# EAGLE design RHD2132-Millmax-RightAngle (EAGLE 9.6.2)
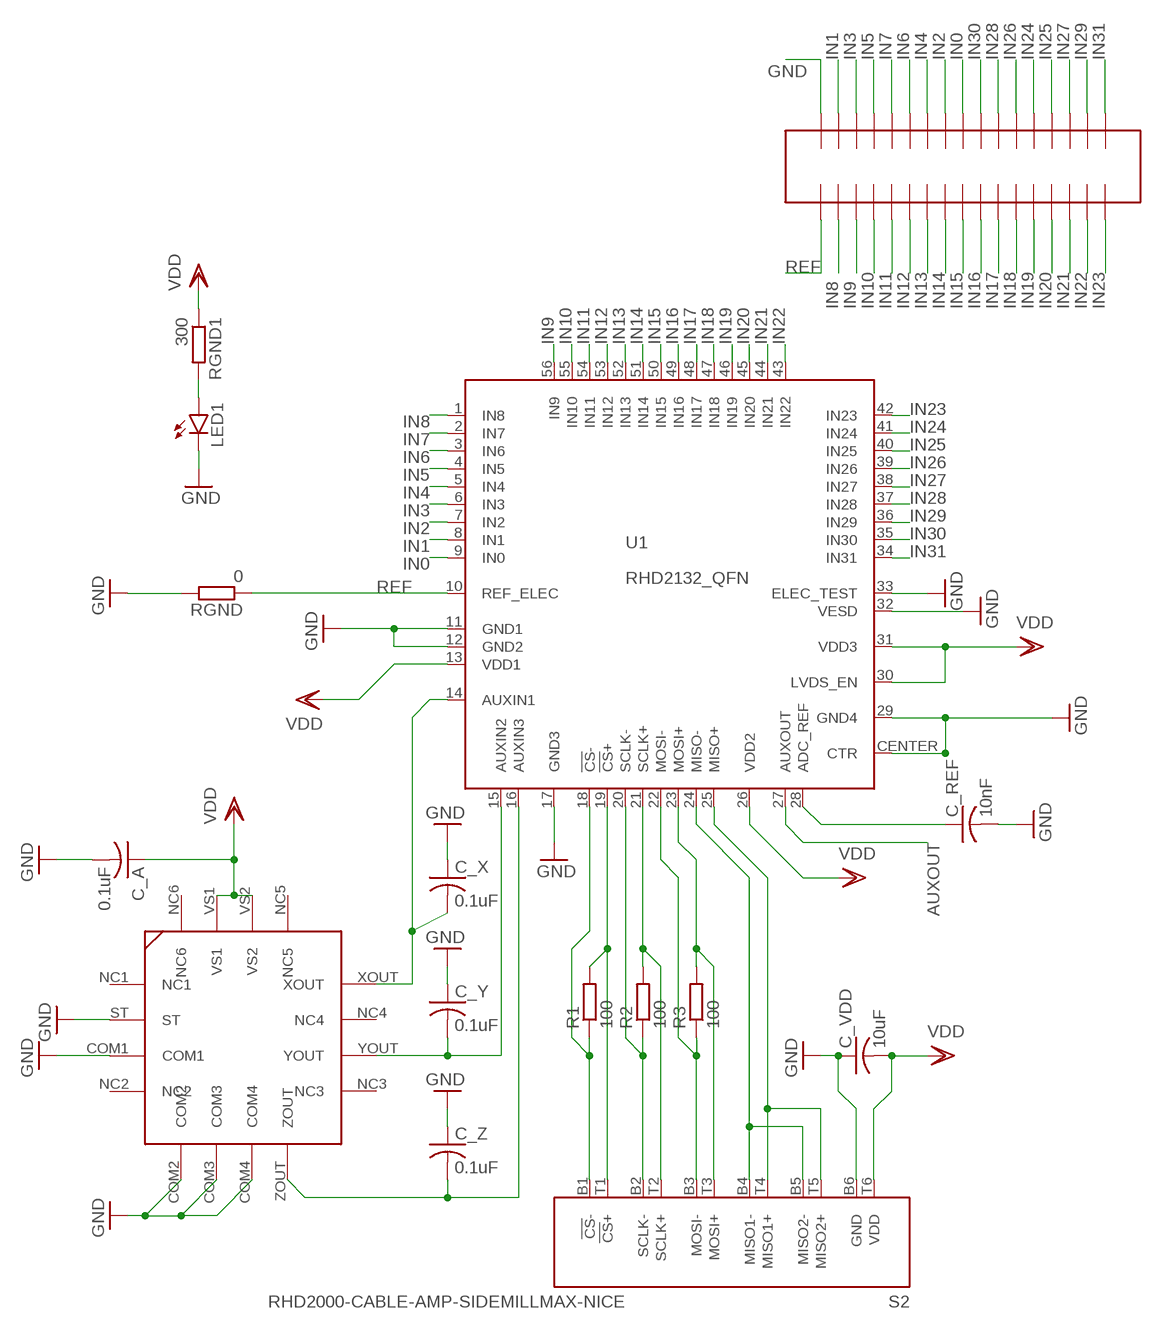
[diagram p0: schematic, sheet 1]

## Parts
C_A  0.1uF  C-USC0402K  [C0402K]
C_REF  10nF  C-USC0402K  [C0402K]
C_VDD  10uF  C-USC1206  [C1206]
C_X  0.1uF  C-USC0402K  [C0402K]
C_Y  0.1uF  C-USC0402K  [C0402K]
C_Z  0.1uF  C-USC0402K  [C0402K]
LED1  LEDCHIPLED_0805  [CHIPLED_0805]
R1  100  R-EU_R0402  [R0402]
R2  100  R-EU_R0402  [R0402]
R3  100  R-EU_R0402  [R0402]
RGND  0  R-EU_R0402  [R0402]
RGND1  300  R-EU_R0402  [R0402]
S2  RHD2000-CABLE-AMP-SIDEMILLMAX-NICE  [MILLMAX-12PIN-NICE]
U1  RHD2132_QFN  [QFN56_8_X_8_LARGE]
U$1  ADXL335  [ADXL335]
U$2  FTSH-117BOARD-END  [FTSH-117-END]

## Nets
ADC_REF: C_REF.1 U1.28(ADC_REF)
AUXOUT: U1.27(AUXOUT)
CS+: R1.2 S2.T1(!CS!+) U1.19(!CS!+)
CS-: R1.1 S2.B1(!CS!-) U1.18(!CS!-)
GND: C_A.2 C_REF.2 C_VDD.1 C_X.1 C_Y.1 C_Z.1 LED1.C RGND.2 S2.B6(GND) U1.11(GND1) U1.12(GND2) U1.17(GND3) U1.29(GND4) U1.32(VESD) U1.33(ELEC_TEST) U1.CENTER(CTR) U$1.COM1 U$1.COM2 U$1.COM3 U$1.COM4 U$1.ST U$2.P$34
IN0: U1.9(IN0) U$2.P$26
IN1: U1.8(IN1) U$2.P$33
IN2: U1.7(IN2) U$2.P$27
IN3: U1.6(IN3) U$2.P$32
IN4: U1.5(IN4) U$2.P$28
IN5: U1.4(IN5) U$2.P$31
IN6: U1.3(IN6) U$2.P$29
IN7: U1.2(IN7) U$2.P$30
IN8: U1.1(IN8) U$2.P$2
IN9: U1.56(IN9) U$2.P$3
IN10: U1.55(IN10) U$2.P$4
IN11: U1.54(IN11) U$2.P$5
IN12: U1.53(IN12) U$2.P$6
IN13: U1.52(IN13) U$2.P$7
IN14: U1.51(IN14) U$2.P$8
IN15: U1.50(IN15) U$2.P$9
IN16: U1.49(IN16) U$2.P$10
IN17: U1.48(IN17) U$2.P$11
IN18: U1.47(IN18) U$2.P$12
IN19: U1.46(IN19) U$2.P$13
IN20: U1.45(IN20) U$2.P$14
IN21: U1.44(IN21) U$2.P$15
IN22: U1.43(IN22) U$2.P$16
IN23: U1.42(IN23) U$2.P$17
IN24: U1.41(IN24) U$2.P$22
IN25: U1.40(IN25) U$2.P$21
IN26: U1.39(IN26) U$2.P$23
IN27: U1.38(IN27) U$2.P$20
IN28: U1.37(IN28) U$2.P$24
IN29: U1.36(IN29) U$2.P$19
IN30: U1.35(IN30) U$2.P$25
IN31: U1.34(IN31) U$2.P$18
MISO1+: S2.T4(MISO1+) S2.T5(MISO2+) U1.25(MISO+)
MISO1-: S2.B4(MISO1-) S2.B5(MISO2-) U1.24(MISO-)
MOSI+: R3.2 S2.T3(MOSI+) U1.23(MOSI+)
MOSI-: R3.1 S2.B3(MOSI-) U1.22(MOSI-)
N$1: LED1.A RGND1.2
REF: RGND.1 U1.10(REF_ELEC) U$2.P$1
SCLK+: R2.2 S2.T2(SCLK+) U1.21(SCLK+)
SCLK-: R2.1 S2.B2(SCLK-) U1.20(SCLK-)
VDD: C_A.1 C_VDD.2 RGND1.1 S2.T6(VDD) U1.13(VDD1) U1.26(VDD2) U1.30(LVDS_EN) U1.31(VDD3) U$1.VS1 U$1.VS2
XOUT: C_X.2 U1.14(AUXIN1) U$1.XOUT
YOUT: C_Y.2 U1.15(AUXIN2) U$1.YOUT
ZOUT: C_Z.2 U1.16(AUXIN3) U$1.ZOUT
Unconnected: U$1.NC1 U$1.NC2 U$1.NC3 U$1.NC4 U$1.NC5 U$1.NC6

## Library data of the parts
C_A C_REF C_VDD C_X C_Y C_Z = resistor:C-US: CAPACITOR, American symbol
LED1 = led:LED: LED OSRAM: - CHIPLED LG R971, LG N971, LY N971, LG Q971, LY Q971, LO R971, LY R971 LH N974, LH R974 LS Q976, LO Q976, LY Q976 LO Q996 - Hyper CHIPLED LW Q18S LB Q993, LB Q99A, LB R99A - SideLED LS A670, LO A670, LY A670, LG A670, LP A670 LB A673, LV A673, LT A673, LW A673 LH A674 LY A675 LS A676, LA A676, LO A676, LY A676, LW A676 LS A679, LY A679, LG A679 - Hyper Micro SIDELED® LS Y876, LA Y876, LO Y876, LY Y876 LT Y87S - SmartLED LW L88C, LW L88S LB L89C, LB L89S, LG L890 LS L89K, LO L89K, LY L89K LS L896, LA L896, LO L896, LY L896 - TOPLED LS T670, LO T670, LY T670, LG T670, LP T670 LSG T670, LSP T670, LSY T670, LOP T670, LYG T670 LG T671, LOG T671, LSG T671 LB T673, LV T673, LT T673, LW T673 LH T674 LS T676, LA T676, LO T676, LY T676, LB T676, LH T676, LSB T676, LW T676 LB T67C, LV T67C, LT T67C, LS T67K, LO T67K, LY T67K, LW E67C LS E67B, LA E67B, LO E67B, LY E67B, LB E67C, LV E67C, LT E67C LW T67C LS T679, LY T679, LG T679 LS T770, LO T770, LY T770, LG T770, LP T770 LB T773, LV T773, LT T773, LW T773 LH T774 LS E675, LA E675, LY E675, LS T675 LS T776, LA T776, LO T776, LY T776, LB T776 LHGB T686 LT T68C, LB T68C - Hyper Mini TOPLED® LB M676 - Mini TOPLED Santana® LG M470 LS M47K, LO M47K, LY M47K Source: http://www.osram.convergy.de LUXEON: - LUMILED® LXK2-PW12-R00, LXK2-PW12-S00, LXK2-PW14-U00, LXK2-PW14-V00 LXK2-PM12-R00, LXK2-PM12-S00, LXK2-PM14-U00 LXK2-PE12-Q00, LXK2-PE12-R00, LXK2-PE12-S00, LXK2-PE14-T00, LXK2-PE14-U00 LXK2-PB12-K00, LXK2-PB12-L00, LXK2-PB12-M00, LXK2-PB14-N00, LXK2-PB14-P00, LXK2-PB14-Q00 LXK2-PR12-L00, LXK2-PR12-M00, LXK2-PR14-Q00, LXK2-PR14-R00 LXK2-PD12-Q00, LXK2-PD12-R00, LXK2-PD12-S00 LXK2-PH12-R00, LXK2-PH12-S00 LXK2-PL12-P00, LXK2-PL12-Q00, LXK2-PL12-R00 Source: www.luxeon.com KINGBRIGHT: KA-3528ASYC Source: www.kingbright.com
R1-R3 RGND RGND1 = resistor:R-EU_: RESISTOR, European symbol
S2 = RHD2132-Millmax-RightAngle:RHD2000-CABLE-AMP-SIDE: Omnetics A79623 PZN-12-AA connector for SPI interface (amplifier side)
U1 = RHD2000:RHD2132: Intan Technologies RHD2132 chip
U$1 = RHD2132-Millmax-RightAngle:ADXL335: The ADXL335 is a small, thin, low power, complete 3-axis accelerometer with signal conditioned voltage outputs. The product measures acceleration with a minimum full-scale range of ±3 g. It can measure the static acceleration of gravity in tilt-sensing applications, as well as dynamic acceleration resulting from motion, shock, or vibration. The user selects the bandwidth of the accelerometer using the CX, CY, and CZ capacitors at the XOUT, YOUT, and ZOUT pins. Bandwidths can be selected to suit the application, with a range of 0.5 Hz to 1600 Hz for the X and Y axes, and a range of 0.5 Hz to 550 Hz for the Z axi
U$2 = Samtec50Mil:FTSH-117: FTSH-117 17x2 Samtec Header 2 row 50 mil spacing

## Board
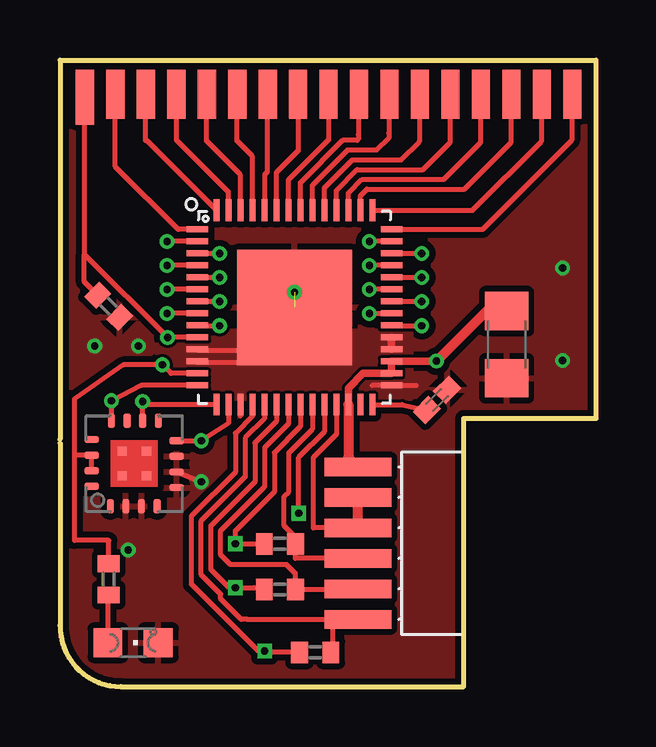
[diagram p1: board, top side]
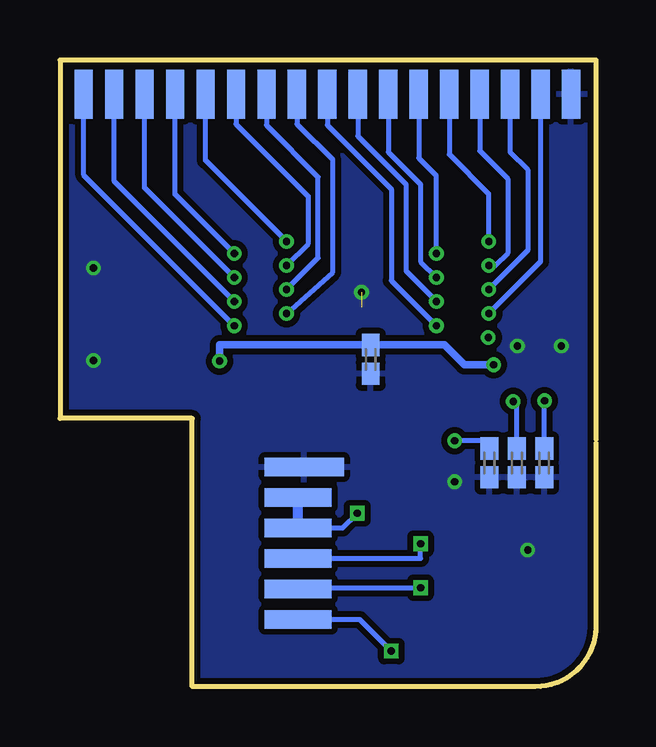
[diagram p2: board, bottom side, seen from below]

Size 22.35 x 26.11 mm. Coordinates in mm from the lower left corner, seen from the top.
Outline: 0,10.3 0,26.11 22.35,26.11 22.35,11.18 16.84,11.18 16.84,0 2.54,0 arc-90 0,2.54 0,10.16
Copper layers (1*16): Top 0.035mm / dielectric 1.5mm / Bottom 0.035mm
Design rules "MF_Standard_2_Layer": minimum track width 5mil, minimum drill 12mil, track to track 5mil, track to pad 5mil, pad to pad 5mil, via to via 5mil, smd to smd 0mil, copper to edge 10mil, drill to drill 10mil, minimum pad ring 6mil, minimum via ring 6mil, stop-mask expansion 2mil, vias tented up to drill 25mil, thermal gap 10mil

### Footprints (pad centres in the part's own frame; a part is rotated, then mirrored left to right if it is on the bottom)
C0402K = smd 0.925 x 0.74: 1 -0.6,0; 2 0.6,0
C1206 = smd 1.6 x 1.8: 1 -1.4,0; 2 1.4,0
CHIPLED_0805 = smd 1.2 x 1.2: A 0,-1.05; C 0,1.05
R0402 = smd 0.7 x 0.9: 1 -0.65,0; 2 0.65,0
MILLMAX-12PIN-NICE = smd 0.762 x 2.794 bottom: B1 3.175,-3.429; B2 1.905,-3.429; B3 0.635,-3.429; B4 -0.635,-3.429; B5 -1.905,-3.429 | smd 0.762 x 3.302 bottom: B6 -3.175,-3.683 | smd 0.762 x 2.794: T1 3.175,-3.429; T2 1.905,-3.429; T3 0.635,-3.429; T4 -0.635,-3.429; T5 -1.905,-3.429; T6 -3.175,-3.429
QFN56_8_X_8_LARGE = smd 0.9 x 0.25: 1 -4.05,3.25; 2 -4.05,2.75; 3 -4.05,2.25; 4 -4.05,1.75; 5 -4.05,1.25; 6 -4.05,0.75; 7 -4.05,0.25; 8 -4.05,-0.25; 9 -4.05,-0.75; 10 -4.05,-1.25; 11 -4.05,-1.75; 12 -4.05,-2.25; 13 -4.05,-2.75; 14 -4.05,-3.25; 29 4.05,-3.25; 30 4.05,-2.75; 31 4.05,-2.25; 32 4.05,-1.75; 33 4.05,-1.25; 34 4.05,-0.75; 35 4.05,-0.25; 36 4.05,0.25; 37 4.05,0.75; 38 4.05,1.25; 39 4.05,1.75; 40 4.05,2.25; 41 4.05,2.75; 42 4.05,3.25 | smd 0.25 x 0.9: 15 -3.25,-4.05; 16 -2.75,-4.05; 17 -2.25,-4.05; 18 -1.75,-4.05; 19 -1.25,-4.05; 20 -0.75,-4.05; 21 -0.25,-4.05; 22 0.25,-4.05; 23 0.75,-4.05; 24 1.25,-4.05; 25 1.75,-4.05; 26 2.25,-4.05; 27 2.75,-4.05; 28 3.25,-4.05; 43 3.25,4.05; 44 2.75,4.05; 45 2.25,4.05; 46 1.75,4.05; 47 1.25,4.05; 48 0.75,4.05; 49 0.25,4.05; 50 -0.25,4.05; 51 -0.75,4.05; 52 -1.25,4.05; 53 -1.75,4.05; 54 -2.25,4.05; 55 -2.75,4.05; 56 -3.25,4.05 | smd 4.8 x 4.8: CENTER 0,0 | smd 0.635 x 0.635: P$1 -1.905,1.905; P$2 -0.635,1.905; P$3 0.635,1.905; P$4 1.905,1.905; P$5 1.905,0.635; P$6 0.635,0.635; P$7 -0.635,0.635; P$8 -1.905,0.635; P$9 -1.905,-0.635; P$10 -0.635,-0.635; P$11 0.635,-0.635; P$12 1.905,-0.635; P$13 1.905,-1.905; P$14 0.635,-1.905; P$15 -0.635,-1.905; P$16 -1.905,-1.905
ADXL335 = smd 0.61 x 0.305: COM1 -1.775,-0.3; NC1 -1.775,1; NC2 -1.775,-0.95; NC3 1.775,-1; NC4 1.775,0.3; ST -1.775,0.35; XOUT 1.775,0.95; YOUT 1.775,-0.35 | smd 0.305 x 0.61: COM2 -1,-1.775; COM3 -0.35,-1.775; COM4 0.3,-1.775; NC5 1,1.775; NC6 -0.95,1.775; VS1 0.35,1.775; VS2 -0.3,1.775; ZOUT 0.95,-1.775 | smd 0.381 x 0.381: P$1 -0.508,0.508; P$2 0.508,0.508; P$3 0.508,-0.508; P$4 -0.508,-0.508
FTSH-117-END = smd 0.762 x 2.286: P$1 -10.16,-0.127 | smd 0.762 x 2.032: P$2 -8.89,0; P$3 -7.62,0; P$4 -6.35,0; P$5 -5.08,0; P$6 -3.81,0; P$7 -2.54,0; P$8 -1.27,0; P$9 0,0; P$10 1.27,0; P$11 2.54,0; P$12 3.81,0; P$13 5.08,0; P$14 6.35,0; P$15 7.62,0; P$16 8.89,0; P$17 10.16,0 | smd 0.762 x 2.032 bottom: P$18 10.16,0; P$19 8.89,0; P$20 7.62,0; P$21 6.35,0; P$22 5.08,0; P$23 3.81,0; P$24 2.54,0; P$25 1.27,0; P$26 0,0; P$27 -1.27,0; P$28 -2.54,0; P$29 -3.81,0; P$30 -5.08,0; P$31 -6.35,0; P$32 -7.62,0; P$33 -8.89,0; P$34 -10.16,0

### Placement (x,y rotation side)
C_A  9.4,13.64 270 bottom
C_REF  15.73,11.95 45 top
C_VDD  18.63,14.25 90 top
C_X  2.16,9.32 90 bottom
C_Y  3.3,9.32 90 bottom
C_Z  4.45,9.32 90 bottom
LED1  3.05,1.83 270 top
R1  10.64,1.43 0 top
R2  9.17,4.05 0 top
R3  9.17,5.95 0 top
RGND  2.03,15.85 315 top
RGND1  2.03,4.47 270 top
S2  15.85,5.98 270 top
U1  9.78,15.8 0 top
U$1  3.1,9.3 90 top
U$2  11.2,24.69 0 top

### Tracks (layer width: path | path; a pad name or v marks a point on that pad's centre or on a via)
ADC_REF
  Top 0.203: U1.28 14.26,11.75 C_REF.1
CS+
  Top 0.203: 11.38,2.8 7.82,2.8 7.56,2.8 6.71,3.66 6.71,3.86 5.89,4.67 5.89,6.91 7.72,8.74 7.72,10.36 8.53,11.17 U1.19 | 11.38,2.8 S2.T1 | R1.2 11.38,1.52 11.38,2.8
CS-  (via drill 0.3)
  Top 0.203: R1.1 8.58,1.43 v8.53,1.48 8.27,1.48 5.49,4.27 5.49,7.11 7.32,8.94 7.32,10.57 8.03,11.28 U1.18
  Bottom 0.203: S2.B1 9.85,2.8 v8.53,1.48
GND  (via drill 0.3)  (1 unrouted)
  Top 0.203: 5.71,14.02 8,14.02 | 5.71,13.51 7.75,13.51 8.26,14.02 8,14.02 | 8,14.02 9.78,15.29 | U1.17 7.53,11.29 | 14.86,12.55 U1.29 13.03,12.55 | U$1.COM3 v5.89,8.54
  Top 0.305: U1.32 U1.33
  other vias: 9.78,16.43 1.45,14.2 20.95,17.45 3.28,14.2 2.84,5.7 20.95,13.59
  pour Top (isolate 0.254, rank 2): 0,25.91 0,0 16.64,0 16.64,11.18 22.35,11.18 22.35,25.91
  pour Bottom (isolate 0.254): 0,25.91 0,0 16.64,0 16.64,11.18 22.35,11.18 22.35,14.63 22.05,25.91
  pour Top (no thermals): 14.63,11.99 4.06,11.99 4.06,14.83 14.63,14.83
IN0  (via drill 0.3)
  Top 0.203: v6.66,15.04 5.59,15.04 5.6,15.05 U1.9
  Bottom 0.203: v6.66,15.04 8.53,16.92 8.53,20.73 11.2,23.39 U$2.P$26
IN1  (via drill 0.3)
  Top 0.203: U1.8 v4.47,15.55
  Bottom 0.203: U$2.P$33 2.31,17.71 v4.47,15.55
IN2  (via drill 0.3)
  Top 0.203: 5.46,16.05 U1.7 | U1.7 v6.66,16.05 | U1.7
  Bottom 0.203: v6.66,16.05 7.92,17.32 7.92,20.93 9.93,22.94 U$2.P$27
IN3  (via drill 0.3)
  Top 0.203: U1.6 v4.47,16.55
  Bottom 0.203: U$2.P$32 3.58,22.28 2.85,21.54 2.85,18.17 v4.47,16.55
IN4  (via drill 0.3)
  Top 0.203: U1.5 v6.66,17.05
  Bottom 0.203: v6.66,17.05 7.32,17.71 7.32,20.93 8.66,22.28 U$2.P$28
IN5  (via drill 0.3)
  Top 0.203: U1.4 v4.47,17.55
  Bottom 0.203: v4.47,17.55 4.19,17.55 3.66,18.09 3.66,21.13 4.85,22.33 U$2.P$31
IN6  (via drill 0.3)
  Top 0.203: U1.3 v6.66,18.05
  Bottom 0.203: v6.66,18.05 6.66,21.29 7.39,22.02 U$2.P$29
IN7  (via drill 0.3)
  Top 0.203: U1.2 v4.47,18.55
  Bottom 0.203: U$2.P$30 6.12,22.17 4.47,20.52 v4.47,18.55
IN8
  Top 0.203: U1.1 4.93,19.05 2.29,21.69 2.29,22.81 U$2.P$2
IN9
  Top 0.203: U$2.P$3 3.56,22.76 3.62,22.76 U1.56
IN10
  Top 0.203: U$2.P$4 4.85,22.78 7.03,20.61 U1.55
IN11
  Top 0.203: U$2.P$5 6.1,22.76 7.53,21.32 U1.54
IN12
  Top 0.203: U1.53 8.03,22.09 7.37,22.76 U$2.P$6
IN13
  Top 0.203: U$2.P$7 8.64,23.27 8.64,21.44 8.53,21.34 U1.52
IN14
  Top 0.203: U1.51 9.03,21.42 9.93,22.33 U$2.P$8
IN15
  Top 0.203: U$2.P$9 11.2,22.78 9.53,21.11 U1.50
IN16
  Top 0.203: U$2.P$10 12.45,23.01 12.45,22.81 12.39,22.76 11.79,22.76 10.03,21 U1.49
IN17
  Top 0.203: U1.48 10.53,20.89 11.99,22.35 13.21,22.35 13.72,22.86 13.72,23.06 U$2.P$11
IN18
  Top 0.203: U1.47 11.03,20.78 12.19,21.95 14.22,21.95 14.99,22.71 U$2.P$12
IN19
  Top 0.203: U$2.P$13 16.26,22.66 15.14,21.54 12.39,21.54 11.53,20.67 U1.46
IN20
  Top 0.203: U1.45 12.03,20.56 12.6,21.13 16,21.13 17.53,22.66 U$2.P$14
IN21
  Top 0.203: U1.44 12.53,20.45 12.8,20.73 16.87,20.73 18.8,22.66 U$2.P$15
IN22
  Top 0.203: U$2.P$16 20.07,22.71 17.21,19.85 U1.43
IN23
  Top 0.203: U$2.P$17 21.34,22.76 17.63,19.05 U1.42
IN24  (via drill 0.3)
  Top 0.203: U1.41 v12.9,18.55
  Bottom 0.203: v12.9,18.55 16.28,21.93 U$2.P$22
IN25  (via drill 0.3)
  Top 0.203: U1.40 v15.09,18.05
  Bottom 0.203: v15.09,18.05 17.55,20.51 U$2.P$21
IN26  (via drill 0.3)
  Top 0.203: U1.39 v12.9,17.55
  Bottom 0.203: U$2.P$23 15.01,23.44 11.99,20.42 11.99,18.46 v12.9,17.55
IN27  (via drill 0.3)
  Top 0.203: U1.38 v15.09,17.05
  Bottom 0.203: v15.09,17.05 18.82,20.78 U$2.P$20
IN28  (via drill 0.3)
  Top 0.203: U1.37 v12.9,16.55
  Bottom 0.203: U$2.P$24 13.74,23.39 11.58,21.23 11.58,17.87 v12.9,16.55
IN29  (via drill 0.3)
  Top 0.203: v15.09,16.05 U1.36
  Bottom 0.203: v15.09,16.05 20.09,21.06 U$2.P$19
IN30  (via drill 0.3)
  Top 0.203: 14.1,15.54 U1.35 | U1.35 v12.9,15.54 | U1.35
  Bottom 0.203: v12.9,15.54 10.97,17.27 10.97,21.95 12.47,23.44 U$2.P$25
IN31  (via drill 0.3)
  Top 0.203: v15.09,15.04 13.84,15.04 U1.34
  Bottom 0.203: v15.09,15.04 21.36,21.31 U$2.P$18
MISO1+
  Top 0.203: S2.T4 10.56,6.61 10.56,9.55 11.53,10.51 U1.25
  Top 0.406: S2.T4 S2.T5
MISO1-  (via drill 0.3)
  Top 0.203: v9.96,7.23 9.96,9.55 11.03,10.62 U1.24
  Bottom 0.203: S2.B4 10.56,6.61 v9.96,7.23
  Bottom 0.406: S2.B4 S2.B5
MOSI+
  Top 0.203: S2.T3 9.82,5.34 R3.2 9.82,6.24 9.35,6.71 9.35,7.92 9.55,8.13 9.55,9.75 10.53,10.73 U1.23
MOSI-  (via drill 0.3)
  Top 0.203: R3.1 v7.32,5.95 7.32,6.5 8.94,8.13 8.94,9.75 10.03,10.84 U1.22
  Bottom 0.203: S2.B3 7.32,5.34 v7.32,5.95
N$1
  Top 0.203: RGND1.2 2,3.62 LED1.A
REF  (via drill 0.3)
  Top 0.203: U$2.P$1 1.02,22.76 1.02,18.02 | U1.10 v4.49,14.55 1.02,18.02 | RGND.1 1.02,16.87 1.02,18.02
SCLK+
  Top 0.203: S2.T2 12.42,4.05 R2.2 9.82,4.71 9.45,5.08 7.11,5.08 6.71,5.49 6.71,6.5 8.53,8.33 8.53,9.96 9.53,10.95 U1.21
SCLK-  (via drill 0.3)
  Top 0.203: R2.1 8.11,4.12 v7.32,4.12 7.05,4.12 6.3,4.88 6.3,6.71 8.13,8.53 8.13,10.16 9.03,11.06 U1.20
  Bottom 0.203: S2.B2 12.42,4.12 v7.32,4.12
VDD  (via drill 0.3)
  Top 0.203: U1.13 4.63,13.05 v4.27,13.41 2.64,13.41 0.61,11.99 0.61,9.65 | U$1.VS2 U$1.VS1 0.61,9.65 | 15.7,13.55 v15.7,13.56 | RGND1.1 2.03,6.1 0.61,6.1 0.61,9.65
  Top 0.305: 15.7,13.55 U1.31 U1.30 12.64,13.05 12.03,12.44 U1.26
  Top 0.406: U1.26 12.03,9.54 S2.T6 | C_VDD.2 17.78,15.65 v15.7,13.56
  Bottom 0.305: v4.27,13.41 5.49,13.41 6.32,14.24 C_A.1 15.7,14.24 v15.7,13.56
XOUT  (via drill 0.3)
  Top 0.203: U$1.XOUT v2.15,11.91 3.4,12.55 U1.14
  Bottom 0.203: C_X.2 2.15,9.92 v2.15,11.91
YOUT  (via drill 0.3)
  Top 0.203: U$1.YOUT v3.45,11.89 3.59,11.75 U1.15
  Bottom 0.203: C_Y.2 3.3,11.89 v3.45,11.89
ZOUT  (via drill 0.3)
  Top 0.203: U$1.ZOUT v5.89,10.25 7.03,10.98 U1.16
  Bottom 0.152: C_Z.2 4.42,10.25
  Bottom 0.203: 4.42,10.25 v5.89,10.25

### Text on the board
tValues: 10 nF
tDocu: ref
bDocu: 32ch/64ch headstage / v4.0 (8/2016) / open-ephys.org compatible / (C) 2016 Kemerelab.com | r100